# EAGLE design V-00690-00 (EAGLE 7.2.0)
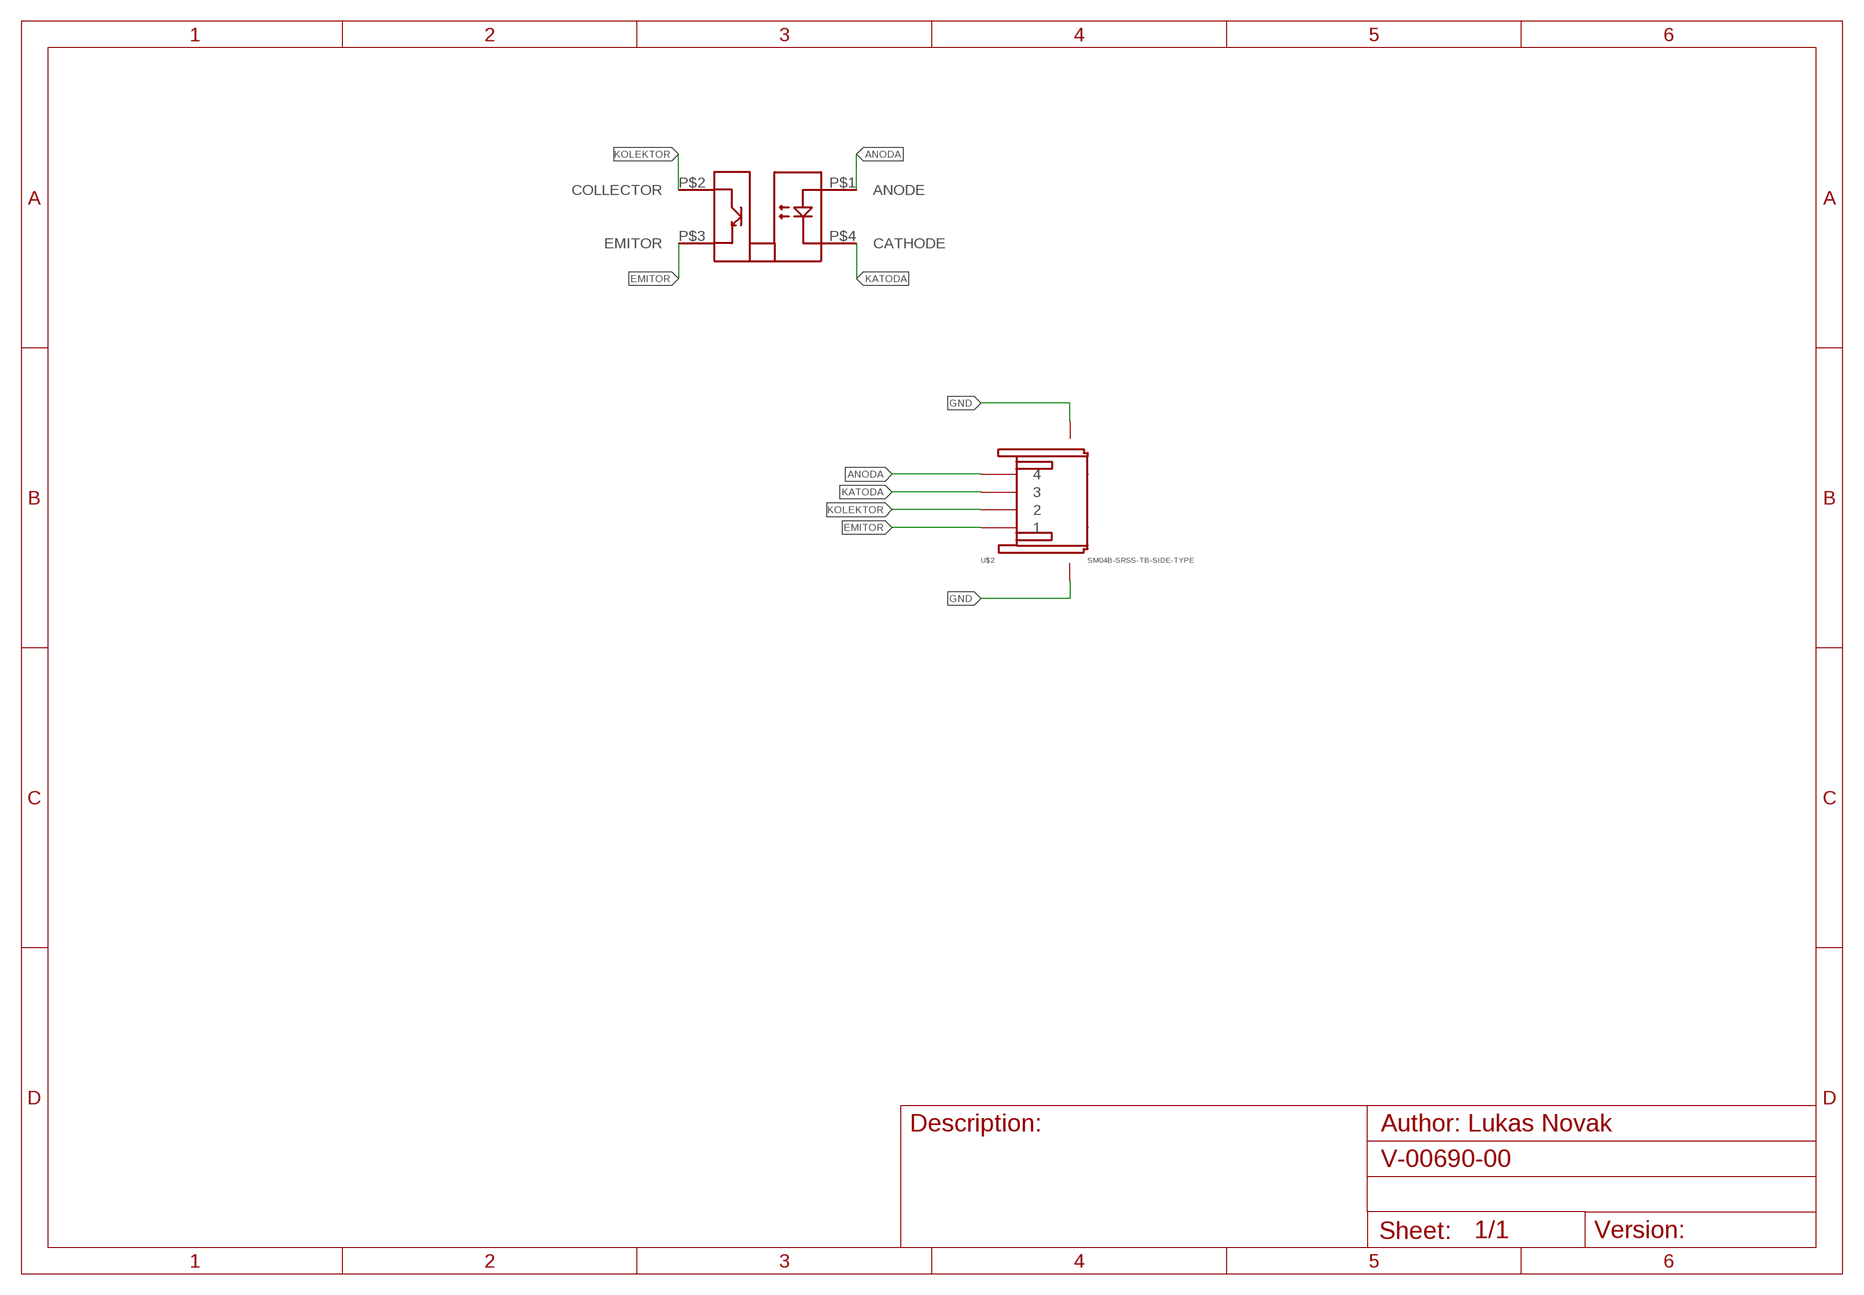
[diagram p0: schematic, sheet 1]

## Parts
U$1  GP1S094HCZ0F-COM  [GP1S094HCZ0F]
U$2  SM04B-SRSS-TB-SIDE-TYPE  [SM04B-SRSS-TB]

## Nets
ANODA: U$1.P$1(ANODE) U$2.P$33
EMITOR: U$1.P$3(EMITOR) U$2.P$1
GND: U$2.GND0 U$2.GND1
KATODA: U$1.P$4(CATHODE) U$2.P$4
KOLEKTOR: U$1.P$2(COLLECTOR) U$2.P$2

## Library data of the parts
U$1 = LIC_ALL-00:GP1S094HCZ0F
U$2 = LIC_ALL-00:SM04B-SRSS-TB

## Board
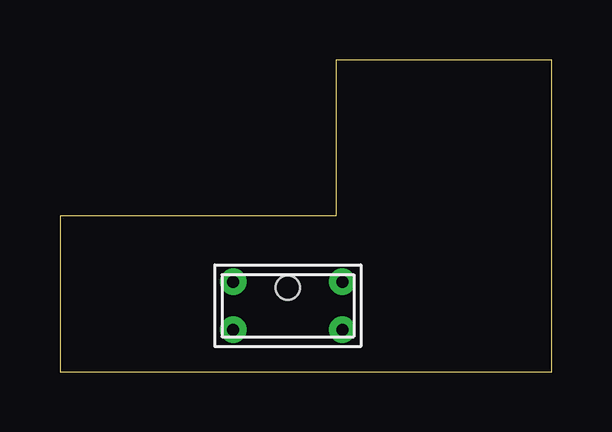
[diagram p1: board, top side]
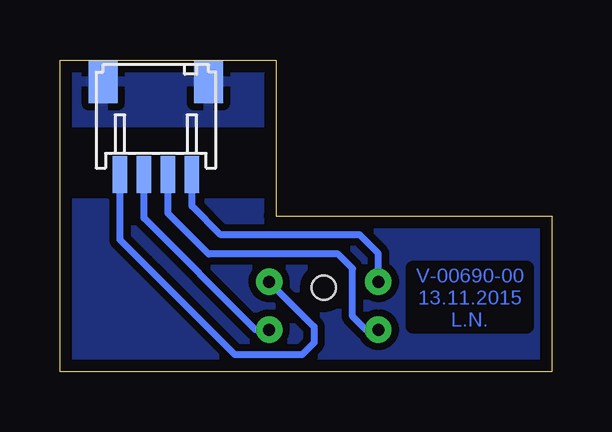
[diagram p2: board, bottom side, seen from below]

Size 20.5 x 13 mm. Coordinates in mm from the lower left corner, seen from the top.
Outline: 0,0 20.5,0 20.5,13 11.5,13 11.5,6.5 0,6.5 0,0
Copper layers (1*16): Top 0.04mm / dielectric 1.5mm / Bottom 0.04mm
Design rules "mucha_navrh": minimum track width 0.2mm, minimum drill 0.3mm, track to track 0.3mm, track to pad 0.3mm, pad to pad 0.3mm, via to via 0.3mm, smd to smd 0mil, copper to edge 0.5mm, drill to drill 0.5mm, minimum pad ring 0.3mm, minimum via ring 0.3mm, stop-mask expansion 0.1mm, vias tented up to drill 0.5mm, thermal gap 0.3mm

### Footprints (pad centres in the part's own frame; a part is rotated, then mirrored left to right if it is on the bottom)
GP1S094HCZ0F = drill 0.5: P$1 2.275,-1.75; P$2 -2.275,-1.75; P$3 -2.275,0.25; P$4 2.275,0.25 | hole 1: 0,0
SM04B-SRSS-TB = smd 1.2 x 1.8: GND0 -2.2,0.9; GND1 2.2,0.9 | smd 0.6 x 1.55: P$1 -1.5,4.775; P$2 -0.5,4.775; P$4 1.5,4.775; P$33 0.5,4.775

### Placement (x,y rotation side)
U$1  9.5,3.5 0 top
U$2  16.5,13 180 bottom

### Tracks (layer width: path | path; a pad name or v marks a point on that pad's centre or on a via)
ANODA
  Bottom 0.3: U$1.P$1 12.35,1.75 17,6.4 U$2.P$33
EMITOR
  Bottom 0.3: U$1.P$3 7.22,4.92 8,5.7 13.8,5.7 15,6.9 U$2.P$1
GND
  pour Bottom: 11.5,13 20.5,13 20.5,10.4 11.5,10.4
KATODA
  Bottom 0.3: U$1.P$4 9.9,1.88 9.9,1.2 10.4,0.7 13.2,0.7 18,5.5 U$2.P$4
KOLEKTOR
  Bottom 0.3: U$1.P$2 7.75,1.75 8.3,2.3 8.3,4.3 8.9,4.9 14.3,4.9 16,6.6 U$2.P$2
N$1
  pour Bottom: 0,0 20.5,0 20.5,7.1 11.5,7.1 11.5,6.5 0,6.5

### Text on the board
Bottom: V-00690-00 / 13.11.2015 / L.N.